# Altium schematic sheet FPGA-Oscilloscope-Memory.SchDoc
size C
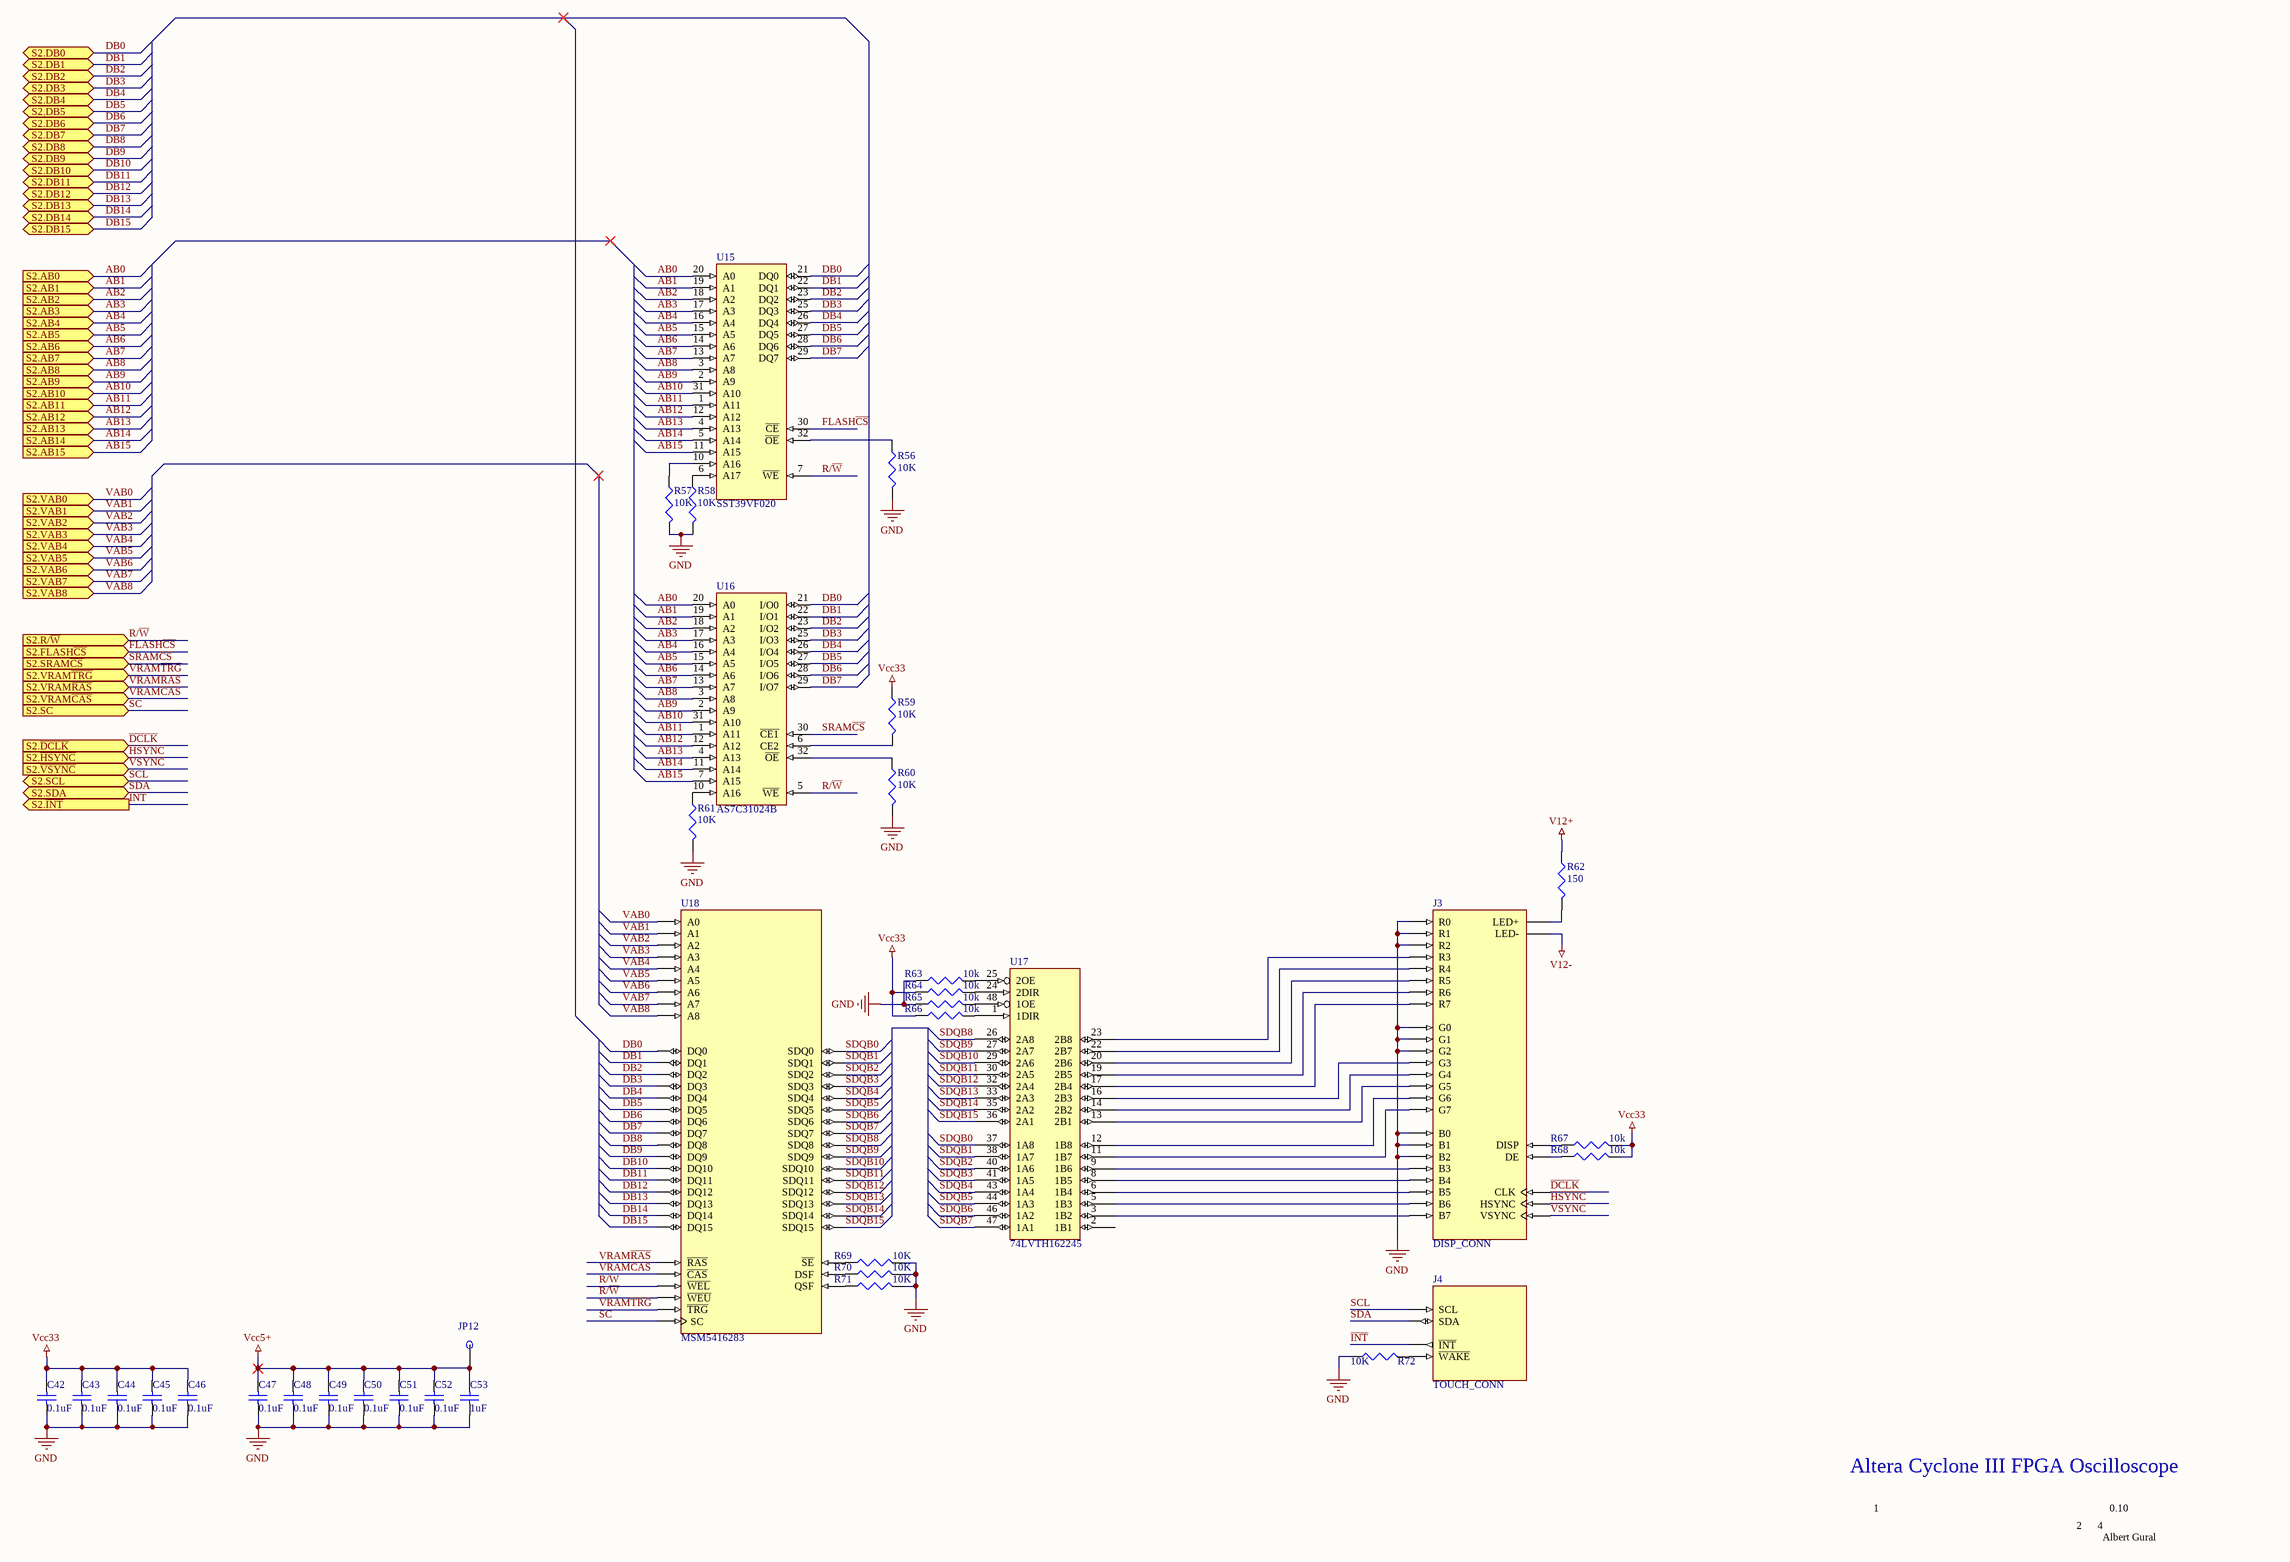
[diagram p0: FPGA-Oscilloscope-Memory.SchDoc]

## Parts
C42  0.1uF  [1608[0603]]
C43  0.1uF  [1608[0603]]
C44  0.1uF  [1608[0603]]
C45  0.1uF  [1608[0603]]
C46  0.1uF  [1608[0603]]
C47  0.1uF  [1608[0603]]
C48  0.1uF  [1608[0603]]
C49  0.1uF  [1608[0603]]
C50  0.1uF  [1608[0603]]
C51  0.1uF  [1608[0603]]
C52  0.1uF  [1608[0603]]
C53  1uF  [1608[0603]]
J3  DISP_CONN  [MOLEX-40]
J4  TOUCH_CONN  [MOLEX-6]
JP12  TestPoint  [TestPoint]  (value not drawn)
R56  10K  [1608[0603]]
R57  10K  [1608[0603]]
R58  10K  [1608[0603]]
R59  10K  [1608[0603]]
R60  10K  [1608[0603]]
R61  10K  [1608[0603]]
R62  150  [1608[0603]]
R63  10k  [1608[0603]]
R64  10k  [1608[0603]]
R65  10k  [1608[0603]]
R66  10k  [1608[0603]]
R67  10k  [1608[0603]]
R68  10k  [1608[0603]]
R69  10K  [1608[0603]]
R70  10K  [1608[0603]]
R71  10K  [1608[0603]]
R72  10K  [1608[0603]]
U15  SST39VF020  [TSOP-32 8x14mm]
U16  AS7C31024B  [TSOP-32 8x20mm]
U17  74LVTH162245  [TSSOP48]
U18  MSM5416283  [SSOP64]

## Ports
S2.AB0 (in), S2.AB1 (in), S2.AB2 (in), S2.AB3 (in), S2.AB4 (in), S2.AB5 (in), S2.AB6 (in), S2.AB7 (in), S2.AB8 (in), S2.AB9 (in), S2.AB10 (in), S2.AB11 (in), S2.AB12 (in), S2.AB13 (in), S2.AB14 (in), S2.AB15 (in), S2.DB0 (bidir), S2.DB1 (bidir), S2.DB2 (bidir), S2.DB3 (bidir), S2.DB4 (bidir), S2.DB5 (bidir), S2.DB6 (bidir), S2.DB7 (bidir), S2.DB8 (bidir), S2.DB9 (bidir), S2.DB10 (bidir), S2.DB11 (bidir), S2.DB12 (bidir), S2.DB13 (bidir), S2.DB14 (bidir), S2.DB15 (bidir), S2.FLASH~{CS} (in), S2.R/~{W} (in), S2.SC (in), S2.SCL (bidir), S2.SDA (bidir), S2.SRAM~{CS} (in), S2.VAB0 (in), S2.VAB1 (in), S2.VAB2 (in), S2.VAB3 (in), S2.VAB4 (in), S2.VAB5 (in), S2.VAB6 (in), S2.VAB7 (in), S2.VAB8 (in), S2.VRAM~{CAS} (in), S2.VRAM~{RAS} (in), S2.VRAM~{TRG} (in), S2.~{DCLK} (in), S2.~{HSYNC} (in), S2.~{INT} (out), S2.~{VSYNC} (in)

## Nets
GND: C42.1 C43.1 C44.1 C45.1 C46.1 C47.1 C48.1 C49.1 C50.1 C51.1 C52.1 C53.1 J3.3(GND) J3.5(R0) J3.6(R1) J3.7(R2) J3.13(G0) J3.14(G1) J3.15(G2) J3.21(B0) J3.22(B1) J3.23(B2) J3.29(GND) J3.36(GND) J4.2(GND) R56.2 R57.2 R58.2 R60.2 R61.2 R63.1 R65.1 R69.2 R70.2 R71.2 R72.1 U15.24(GND) U16.24(GND) U17.4(GND) U17.10(GND) U17.15(GND) U17.21(GND) U17.28(GND) U17.34(GND) U17.39(GND) U17.45(GND) U18.3(Vss) U18.13(Vss) U18.23(Vss) U18.33(Vss) U18.42(Vss) U18.52(Vss) U18.62(Vss)
V12+: R62.1
V12-: J3.1(LED-)
Vcc5+: C47.2 C48.2 C49.2 C50.2 C51.2 C52.2 C53.2 JP12.1 U18.1(Vcc) U18.8(Vcc) U18.18(Vcc) U18.32(Vcc) U18.47(Vcc) U18.57(Vcc)
Vcc33: C42.2 C43.2 C44.2 C45.2 C46.2 J3.4(VDD) J4.1(VDD) R59.1 R64.1 R66.1 R67.2 R68.2 U15.8(VCC) U16.8(VCC) U17.7(Vcc33) U17.18(Vcc33) U17.31(Vcc33) U17.42(Vcc33)
AB0: U15.20(A0) U16.20(A0) ; port S2.AB0
AB1: U15.19(A1) U16.19(A1) ; port S2.AB1
AB2: U15.18(A2) U16.18(A2) ; port S2.AB2
AB3: U15.17(A3) U16.17(A3) ; port S2.AB3
AB4: U15.16(A4) U16.16(A4) ; port S2.AB4
AB5: U15.15(A5) U16.15(A5) ; port S2.AB5
AB6: U15.14(A6) U16.14(A6) ; port S2.AB6
AB7: U15.13(A7) U16.13(A7) ; port S2.AB7
AB8: U15.3(A8) U16.3(A8) ; port S2.AB8
AB9: U15.2(A9) U16.2(A9) ; port S2.AB9
AB10: U15.31(A10) U16.31(A10) ; port S2.AB10
AB11: U15.1(A11) U16.1(A11) ; port S2.AB11
AB12: U15.12(A12) U16.12(A12) ; port S2.AB12
AB13: U15.4(A13) U16.4(A13) ; port S2.AB13
AB14: U15.5(A14) U16.11(A14) ; port S2.AB14
AB15: U15.11(A15) U16.7(A15) ; port S2.AB15
~{DCLK}: J3.30(CLK) ; port S2.~{DCLK}
DB0: U15.21(DQ0) U16.21(I/O0) U18.5(DQ0) ; port S2.DB0
DB1: U15.22(DQ1) U16.22(I/O1) U18.7(DQ1) ; port S2.DB1
DB2: U15.23(DQ2) U16.23(I/O2) U18.10(DQ2) ; port S2.DB2
DB3: U15.25(DQ3) U16.25(I/O3) U18.12(DQ3) ; port S2.DB3
DB4: U15.26(DQ4) U16.26(I/O4) U18.15(DQ4) ; port S2.DB4
DB5: U15.27(DQ5) U16.27(I/O5) U18.17(DQ5) ; port S2.DB5
DB6: U15.28(DQ6) U16.28(I/O6) U18.20(DQ6) ; port S2.DB6
DB7: U15.29(DQ7) U16.29(I/O7) U18.22(DQ7) ; port S2.DB7
DB8: U18.43(DQ8) ; port S2.DB8
DB9: U18.45(DQ9) ; port S2.DB9
DB10: U18.48(DQ10) ; port S2.DB10
DB11: U18.50(DQ11) ; port S2.DB11
DB12: U18.53(DQ12) ; port S2.DB12
DB13: U18.55(DQ13) ; port S2.DB13
DB14: U18.58(DQ14) ; port S2.DB14
DB15: U18.60(DQ15) ; port S2.DB15
FLASH~{CS}: U15.30(~{CE}) ; port S2.FLASH~{CS}
~{HSYNC}: J3.32(HSYNC) ; port S2.~{HSYNC}
~{INT}: J4.5(~{INT}) ; port S2.~{INT}
R/~{W}: U15.7(~{WE}) U16.5(~{WE}) U18.24(~{WEL}) U18.25(~{WEU}) ; port S2.R/~{W}
SC: U18.64(SC) ; port S2.SC
SCL: J4.3(SCL) ; port S2.SCL
SDA: J4.4(SDA) ; port S2.SDA
SDQB0: U17.37(1A8) U18.4(SDQ0)
SDQB1: U17.38(1A7) U18.6(SDQ1)
SDQB2: U17.40(1A6) U18.9(SDQ2)
SDQB3: U17.41(1A5) U18.11(SDQ3)
SDQB4: U17.43(1A4) U18.14(SDQ4)
SDQB5: U17.44(1A3) U18.16(SDQ5)
SDQB6: U17.46(1A2) U18.19(SDQ6)
SDQB7: U17.47(1A1) U18.21(SDQ7)
SDQB8: U17.26(2A8) U18.44(SDQ8)
SDQB9: U17.27(2A7) U18.46(SDQ9)
SDQB10: U17.29(2A6) U18.49(SDQ10)
SDQB11: U17.30(2A5) U18.51(SDQ11)
SDQB12: U17.32(2A4) U18.54(SDQ12)
SDQB13: U17.33(2A3) U18.56(SDQ13)
SDQB14: U17.35(2A2) U18.59(SDQ14)
SDQB15: U17.36(2A1) U18.61(SDQ15)
SRAM~{CS}: U16.30(~{CE1}) ; port S2.SRAM~{CS}
~{VSYNC}: J3.33(VSYNC) ; port S2.~{VSYNC}
VAB0: U18.37(A0) ; port S2.VAB0
VAB1: U18.36(A1) ; port S2.VAB1
VAB2: U18.35(A2) ; port S2.VAB2
VAB3: U18.34(A3) ; port S2.VAB3
VAB4: U18.31(A4) ; port S2.VAB4
VAB5: U18.30(A5) ; port S2.VAB5
VAB6: U18.29(A6) ; port S2.VAB6
VAB7: U18.28(A7) ; port S2.VAB7
VAB8: U18.27(A8) ; port S2.VAB8
VRAM~{CAS}: U18.39(~{CAS}) ; port S2.VRAM~{CAS}
VRAM~{RAS}: U18.26(~{RAS}) ; port S2.VRAM~{RAS}
VRAM~{TRG}: U18.2(~{TRG}) ; port S2.VRAM~{TRG}
NetJ3_2: J3.2(LED+) R62.2
NetJ3_8: J3.8(R3) U17.23(2B8)
NetJ3_9: J3.9(R4) U17.22(2B7)
NetJ3_10: J3.10(R5) U17.20(2B6)
NetJ3_11: J3.11(R6) U17.19(2B5)
NetJ3_12: J3.12(R7) U17.17(2B4)
NetJ3_16: J3.16(G3) U17.16(2B3)
NetJ3_17: J3.17(G4) U17.14(2B2)
NetJ3_18: J3.18(G5) U17.13(2B1)
NetJ3_19: J3.19(G6) U17.12(1B8)
NetJ3_20: J3.20(G7) U17.11(1B7)
NetJ3_24: J3.24(B3) U17.9(1B6)
NetJ3_25: J3.25(B4) U17.8(1B5)
NetJ3_26: J3.26(B5) U17.6(1B4)
NetJ3_27: J3.27(B6) U17.5(1B3)
NetJ3_28: J3.28(B7) U17.3(1B2)
NetJ3_31: J3.31(DISP) R67.1
NetJ3_34: J3.34(DE) R68.1
NetJ4_6: J4.6(~{WAKE}) R72.2
NetR56_1: R56.1 U15.32(~{OE})
NetR57_1: R57.1 U15.10(A16)
NetR58_1: R58.1 U15.6(A17)
NetR59_2: R59.2 U16.6(CE2)
NetR60_1: R60.1 U16.32(~{OE})
NetR61_1: R61.1 U16.10(A16)
NetR63_2: R63.2 U17.25(2OE)
NetR64_2: R64.2 U17.24(2DIR)
NetR65_2: R65.2 U17.48(1OE)
NetR66_2: R66.2 U17.1(1DIR)
NetR69_1: R69.1 U18.63(~{SE})
NetR70_1: R70.1 U18.41(DSF)
NetR71_1: R71.1 U18.38(QSF)

Not connected (* = marked no-connect by the designer): U17 2(1B1)

## Notes on the sheet
- Altera Cyclone III FPGA Oscilloscope
- 1
- 2
- 4
- Albert Gural
- 0.10

## Library data of the parts
C42-C53 = Cap Semi: Capacitor (Semiconductor SIM Model); Published: 8-Jun-2000; LatestRevisionDate: 29-May-2009; LatestRevisionNote: IPC-7351 Footprint Added.; PackageReference: C1206; Publisher: Altium Limited; PackageDescription: Chip Capacitor
J3 = NHD-4.3-Display-connector
J4 = NHD-4.3-Touch-connector
R56-R72 = RES1
U15 = SST39VF020: Microchip 2 Mbit (256k x 8 bit) Multi-Purpose Flash
U16 = AS7C31024B: Alliance 1 Mbit (128k x 8bit) SRAM
U17 = 74LVTH162245: 16-Bit Bus Transceiver
U18 = MSM5416283: 256K x 16bit VRAM